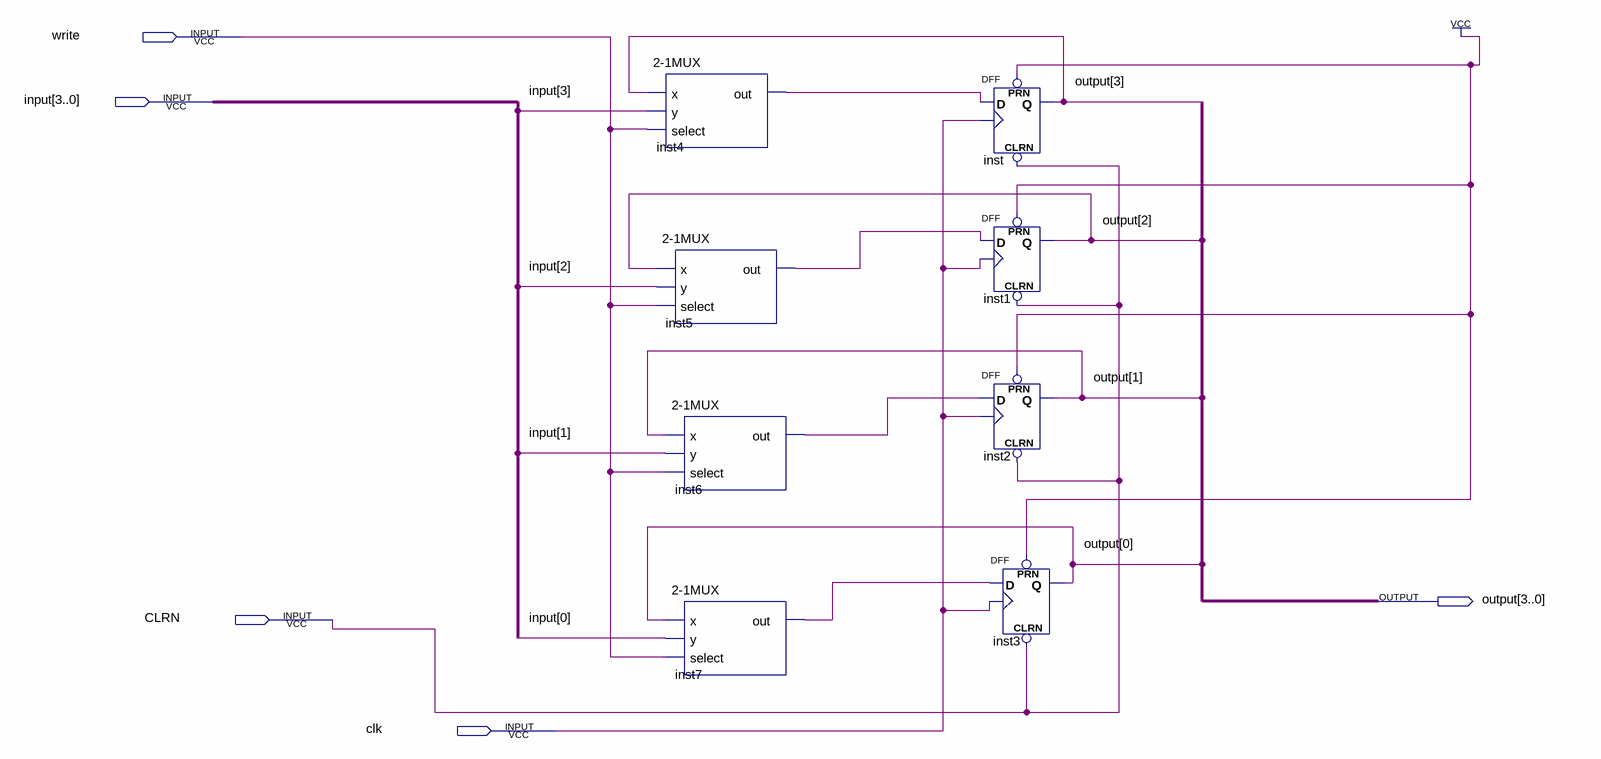
[diagram p0: schematic sheet]
// Quartus schematic register.bdf as structural Verilog: 8 symbols, 5 pins
module register (
  input  write,
  input  [3:0] \input ,
  input  CLRN,
  input  clk,
  output [3:0] \output 
);

  wire inst4_out, inst5_out, inst6_out, inst7_out;

  \2-1MUX  inst4 (.x(\output [3]), .y(\input [3]), .select(write), .out(inst4_out));
  \2-1MUX  inst5 (.x(\output [2]), .y(\input [2]), .select(write), .out(inst5_out));
  \2-1MUX  inst6 (.x(\output [1]), .y(\input [1]), .select(write), .out(inst6_out));
  \2-1MUX  inst7 (.x(\output [0]), .y(\input [0]), .select(write), .out(inst7_out));
  DFF inst (.CLRN(CLRN), .CLK(clk), .D(inst4_out), .PRN(1'b1), .Q(\output [3]));
  DFF inst1 (.CLRN(CLRN), .CLK(clk), .D(inst5_out), .PRN(1'b1), .Q(\output [2]));
  DFF inst2 (.CLRN(CLRN), .CLK(clk), .D(inst6_out), .PRN(1'b1), .Q(\output [1]));
  DFF inst3 (.CLRN(CLRN), .CLK(clk), .D(inst7_out), .PRN(1'b1), .Q(\output [0]));
endmodule
